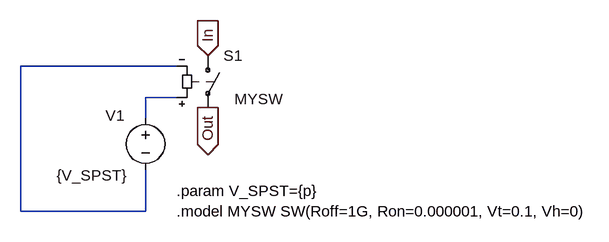
[diagram p0: schematic SPST.asc]
SPST.asc, the LTspice schematic file:
Version 4
SHEET 1 880 680
WIRE 160 336 -80 336
WIRE 160 384 112 384
WIRE 112 416 112 384
WIRE -80 560 -80 336
WIRE 112 560 112 496
WIRE 112 560 -80 560
FLAG 208 320 In
IOPIN 208 320 In
FLAG 208 400 Out
IOPIN 208 400 Out
SYMBOL sw 208 304 R0
WINDOW 3 41 83 Left 2
SYMATTR Value MYSW
SYMATTR InstName S1
SYMBOL voltage 112 400 R0
WINDOW 0 -61 12 Left 2
WINDOW 3 -137 104 Left 2
WINDOW 123 0 0 Left 0
WINDOW 39 0 0 Left 0
SYMATTR InstName V1
SYMATTR Value {V_SPST}
TEXT 160 528 Left 2 !.param V_SPST={p}
TEXT 160 560 Left 2 !.model MYSW SW(Roff=1G, Ron=0.000001, Vt=0.1, Vh=0)

The netlist it stands for:
* SPST.asc
S1 In Out N002 N001 MYSW
V1 N002 N001 {V_SPST}
.param V_SPST={p}
.model MYSW SW(Roff=1G, Ron=0.000001, Vt=0.1, Vh=0)
.backanno
.end